# EAGLE design Risha Mega Shield (EAGLE 6.4)
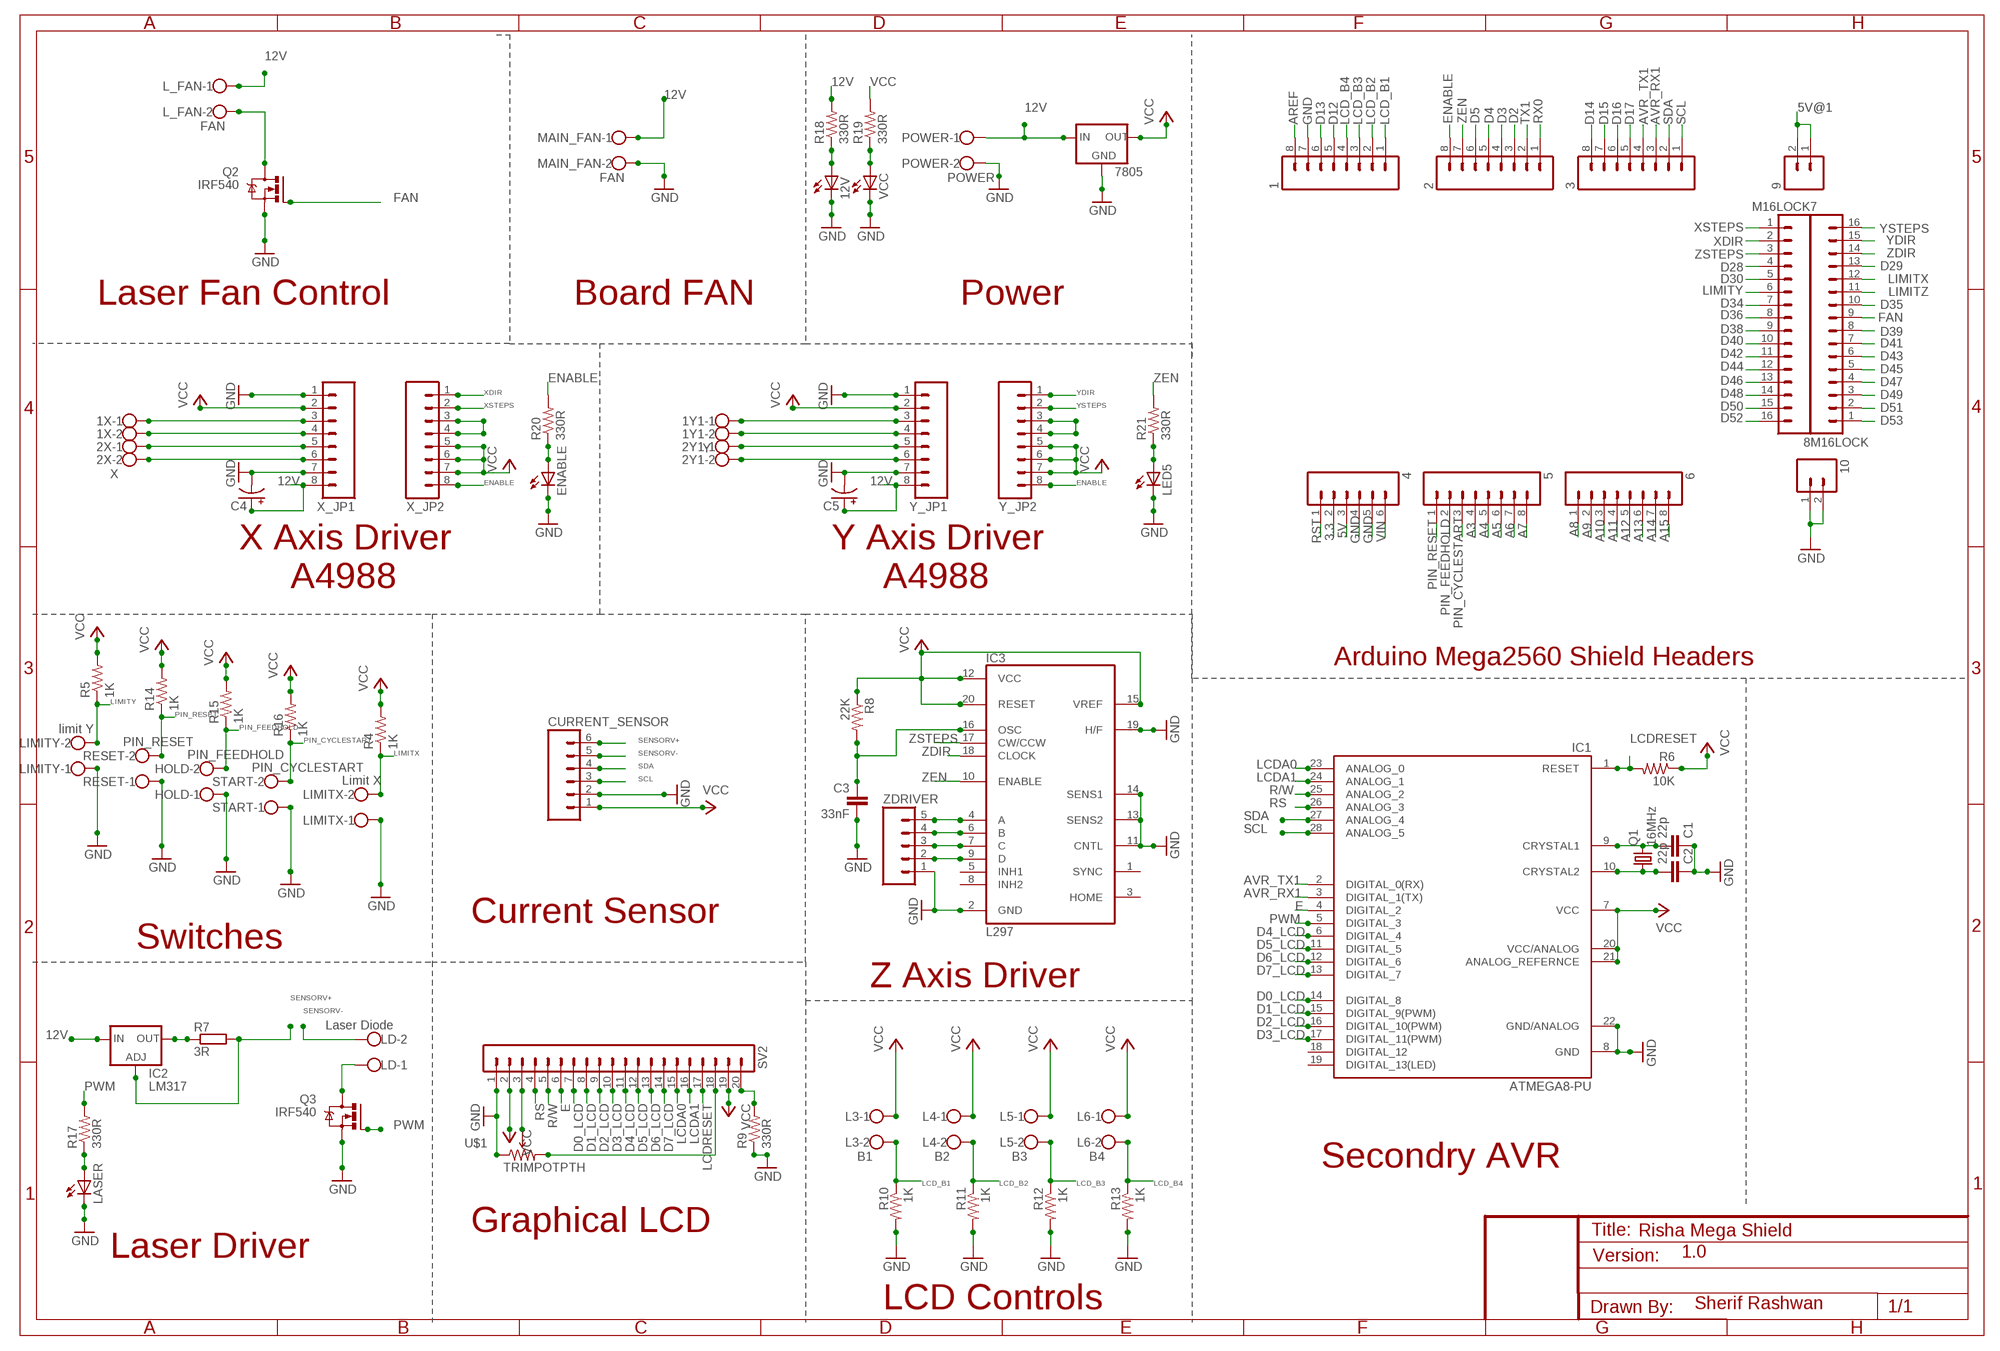
[diagram p0: schematic, sheet 1]

## Parts
1  M08LOCK  [1X08_LOCK]
1X  W237-102  [W237-102]
1Y1  Y  W237-102  [W237-102]
2  M08LOCK  [1X08_LOCK]
2X  X  W237-102  [W237-102]
2Y1  W237-102  [W237-102]
3  M08LOCK  [1X08_LOCK]
4  M06LOCK  [1X06_LOCK]
5  M08LOCK  [1X08_LOCK]
6  M08LOCK  [1X08_LOCK]
7  M16LOCK  [1X16_LOCK]
8  M16LOCK  [1X16_LOCK]
9  M02LOCK  [1X02_LOCK]
10  M02LOCK  [1X02_LOCK]
12V  LED3MM  [LED3MM]
7805  V_REG_78XXSINK  [TO220-IGO]
C1  22p  C2.5/2  [C2.5-2]
C2  22p  C2.5/2  [C2.5-2]
C3  33nF  C2.5/2  [C2.5-2]
C4  CAP_POLPTH2  [CPOL-RADIAL-10UF-25V]
C5  CAP_POLPTH2  [CPOL-RADIAL-10UF-25V]
CURRENT_SENSOR  M06LONGPADS  [1X06_LONGPADS]
ENABLE  LED3MM  [LED3MM]
HOLD  PIN_FEEDHOLD  W237-102  [W237-102]
IC1  ATMEGA8-PU  [DIL28-3]
IC2  LM317  LM317-TO3  [TO3-K02]
IC3  L297  [DIL20]
L3  B1  W237-102  [W237-102]
L4  B2  W237-102  [W237-102]
L5  B3  W237-102  [W237-102]
L6  B4  W237-102  [W237-102]
L_FAN  FAN  W237-102  [W237-102]
LASER  LED3MM  [LED3MM]
LD  Laser Diode  W237-102  [W237-102]
LED5  LED3MM  [LED3MM]
LIMITX  Limit X  W237-102  [W237-102]
LIMITY  limit Y  W237-102  [W237-102]
MAIN_FAN  FAN  W237-102  [W237-102]
POWER  POWER  W237-102  [W237-102]
Q1  16MHz  CRYSTALHC49US  [HC49US]
Q2  IRF540  [TO220BV]
Q3  IRF540  [TO220BV]
R4  1K  RESISTORPTH-1/6W  [1/6W-RES]
R5  1K  RESISTORPTH-1/6W  [1/6W-RES]
R6  10K  RESISTORPTH-1/6W  [1/6W-RES]
R7  3R  R-EU_0309/12  [0309/12]
R8  22K  RESISTORPTH-1/6W  [1/6W-RES]
R9  330R  RESISTORPTH-1/6W  [1/6W-RES]
R10  1K  RESISTORPTH-1/6W  [1/6W-RES]
R11  1K  RESISTORPTH-1/6W  [1/6W-RES]
R12  1K  RESISTORPTH-1/6W  [1/6W-RES]
R13  1K  RESISTORPTH-1/6W  [1/6W-RES]
R14  1K  RESISTORPTH-1/6W  [1/6W-RES]
R15  1K  RESISTORPTH-1/6W  [1/6W-RES]
R16  1K  RESISTORPTH-1/6W  [1/6W-RES]
R17  330R  RESISTORPTH-1/6W  [1/6W-RES]
R18  330R  RESISTORPTH-1/6W  [1/6W-RES]
R19  330R  RESISTORPTH-1/6W  [1/6W-RES]
R20  330R  RESISTORPTH-1/6W  [1/6W-RES]
R21  330R  RESISTORPTH-1/6W  [1/6W-RES]
RESET  PIN_RESET  W237-102  [W237-102]
START  PIN_CYCLESTART  W237-102  [W237-102]
SV2  MA20-1W  [MA20-1W]
U$1  TRIMPOTPTH  [TRIM_POT_PTH]
VCC  LED3MM  [LED3MM]
X_JP1  M08  [1X08]
X_JP2  M08  [1X08]
Y_JP1  M08  [1X08]
Y_JP2  M08  [1X08]
ZDRIVER  M05PTH_LONGPADS  [1X05_LONGPADS]

## Nets
3.3: 4.2
5V: 4.3
5V@1: 9.1 9.2
12V: 7805.IN C4.1(+) C5.1(+) IC2.1(IN) L_FAN.1 MAIN_FAN.1 POWER.1 R18.2 X_JP1.8 Y_JP1.8
A3: 5.4
A4: 5.5
A5: 5.6
A6: 5.7
A7: 5.8
A8: 6.1
A9: 6.2
A10: 6.3
A11: 6.4
A12: 6.5
A13: 6.6
A14: 6.7
A15: 6.8
AREF: 1.8
AVR_RX1: 3.3 IC1.3(DIGITAL_1(TX))
AVR_TX1: 3.4 IC1.2(DIGITAL_0(RX))
D0_LCD: IC1.14(DIGITAL_8) SV2.7
D1_LCD: IC1.15(DIGITAL_9(PWM)) SV2.8
D2: 2.3
D2_LCD: IC1.16(DIGITAL_10(PWM)) SV2.9
D3: 2.4
D3_LCD: IC1.17(DIGITAL_11(PWM)) SV2.10
D4: 2.5
D4_LCD: IC1.6(DIGITAL_4) SV2.11
D5: 2.6
D5_LCD: IC1.11(DIGITAL_5) SV2.12
D6_LCD: IC1.12(DIGITAL_6) SV2.13
D7_LCD: IC1.13(DIGITAL_7) SV2.14
D12: 1.5
D13: 1.6
D14: 3.8
D15: 3.7
D16: 3.6
D17: 3.5
D28: 8.4
D29: 7.13
D30: 8.5
D34: 8.7
D35: 7.10
D36: 8.8
D38: 8.9
D39: 7.8
D40: 8.10
D41: 7.7
D42: 8.11
D43: 7.6
D44: 8.12
D45: 7.5
D46: 8.13
D47: 7.4
D48: 8.14
D49: 7.3
D50: 8.15
D51: 7.2
D52: 8.16
D53: 7.1
E: IC1.4(DIGITAL_2) SV2.6
ENABLE: 2.8 R20.2 X_JP2.8 Y_JP2.8
FAN: 7.9 Q2.G
GND: 1.7 4.4 4.5 10.1 10.2 12V.K(C) 7805.GND C1.1 C2.1 C3.2 C4.2(-) C5.2(-) CURRENT_SENSOR.2 ENABLE.K(C) HOLD.1 IC1.8(GND) IC1.22(GND/ANALOG) IC3.2(GND) IC3.11(CNTL) IC3.13(SENS2) IC3.14(SENS1) IC3.19(H/F) LASER.K(C) LED5.K(C) LIMITX.1 LIMITY.1 MAIN_FAN.2 POWER.2 Q2.S Q3.S R9.1 R10.2 R11.2 R12.2 R13.2 RESET.1 START.1 SV2.1 U$1.1(CCW) VCC.K(C) X_JP1.1 X_JP1.7 Y_JP1.1 Y_JP1.7 ZDRIVER.1
LCD_B1: 1.1 L3.2 R10.1
LCD_B2: 1.2 L4.2 R11.1
LCD_B3: 1.3 L5.2 R12.1
LCD_B4: 1.4 L6.2 R13.1
LCDA0: IC1.23(ANALOG_0) SV2.15
LCDA1: IC1.24(ANALOG_1) SV2.16
LCDRESET: IC1.1(RESET) R6.2 SV2.17
LIMITX: 7.12 LIMITX.2 R4.1
LIMITY: 8.6 LIMITY.2 R5.1
LIMITZ: 7.11
N$1: L_FAN.2 Q2.D
N$2: 1Y1.1 Y_JP1.3
N$3: 1Y1.2 Y_JP1.4
N$4: 2Y1.1 Y_JP1.5
N$5: 2Y1.2 Y_JP1.6
N$6: Y_JP2.3 Y_JP2.4
N$7: C1.2 IC1.9(CRYSTAL1) Q1.2
N$8: C2.2 IC1.10(CRYSTAL2) Q1.1
N$9: LASER.A R17.1
N$10: IC2.3(OUT) R7.1
N$11: LD.1 Q3.D
N$12: IC3.4(A) ZDRIVER.5
N$13: C3.1 IC3.16(OSC) R8.2
N$14: IC3.6(B) ZDRIVER.4
N$15: IC3.7(C) ZDRIVER.3
N$16: IC3.9(D) ZDRIVER.2
N$17: SV2.3 U$1.2(WIPER)
N$18: 12V.A R18.1
N$19: SV2.18 U$1.3(CW)
N$20: R19.1 VCC.A
N$21: ENABLE.A R20.1
N$22: LED5.A R21.1
N$28: 1X.1 X_JP1.3
N$29: 1X.2 X_JP1.4
N$30: 2X.1 X_JP1.5
N$31: 2X.2 X_JP1.6
N$35: X_JP2.3 X_JP2.4
N$40: R9.2 SV2.20
PIN_CYCLESTART: 5.3 R16.1 START.2
PIN_FEEDHOLD: 5.2 HOLD.2 R15.1
PIN_RESET: 5.1 R14.1 RESET.2
PWM: IC1.5(DIGITAL_3) Q3.G R17.2
R/W: IC1.25(ANALOG_2) SV2.5
RS: IC1.26(ANALOG_3) SV2.4
RST: 4.1
RX0: 2.1
SCL: 3.1 CURRENT_SENSOR.3 IC1.28(ANALOG_5)
SDA: 3.2 CURRENT_SENSOR.4 IC1.27(ANALOG_4)
SENSORV+: CURRENT_SENSOR.6 IC2.2(ADJ) R7.2
SENSORV-: CURRENT_SENSOR.5 LD.2
TX1: 2.2
VCC: 7805.OUT CURRENT_SENSOR.1 IC1.7(VCC) IC1.20(VCC/ANALOG) IC1.21(ANALOG_REFERNCE) IC3.12(VCC) IC3.15(VREF) IC3.20(RESET) L3.1 L4.1 L5.1 L6.1 R4.2 R5.2 R6.1 R8.1 R14.2 R15.2 R16.2 R19.2 SV2.2 SV2.19 X_JP1.2 X_JP2.5 X_JP2.6 X_JP2.7 Y_JP1.2 Y_JP2.5 Y_JP2.6 Y_JP2.7
VIN: 4.6
XDIR: 8.2 X_JP2.1
XSTEPS: 8.1 X_JP2.2
YDIR: 7.15 Y_JP2.1
YSTEPS: 7.16 Y_JP2.2
ZDIR: 7.14 IC3.18(CLOCK)
ZEN: 2.7 IC3.10(ENABLE) R21.2
ZSTEPS: 8.3 IC3.17(CW/CCW)
Unconnected: IC1.18(DIGITAL_12) IC1.19(DIGITAL_13(LED)) IC3.1(SYNC) IC3.3(HOME) IC3.5(INH1) IC3.8(INH2)

## Notes on the sheet
- Laser Fan Control | Board FAN | Power
- X Axis Driver | Y Axis Driver
- A4988 | A4988
- Arduino Mega2560 Shield Headers
- Current Sensor
- Switches
- Z Axis Driver
- Secondry AVR
- Graphical LCD
- Laser Driver | 1.0
- LCD Controls | Sherif Rashwan

## Library data of the parts
1-3 5 6 = SparkFun:M08: Header 8 Standard 8-pin 0.1" header. Use with straight break away headers (SKU : PRT-00116), right angle break away headers (PRT-00553), swiss pins (PRT-00743), machine pins (PRT-00117), and female headers (PRT-00115).
1X 1Y1 2X 2Y1 HOLD L3-L6 L_FAN LD LIMITX LIMITY MAIN_FAN POWER RESET START = con-wago-500:W237-102: WAGO SCREW CLAMP; MPN: 237-102; OC_FARNELL: unknown; OC_NEWARK: 70K9898
4 = SparkFun:M06: Header 6 Standard 6-pin 0.1" header. Use with straight break away headers (SKU : PRT-00116), right angle break away headers (PRT-00553), swiss pins (PRT-00743), machine pins (PRT-00117), and female headers (PRT-00115). Molex polarized connector foot print use with SKU : PRT-08094 with associated crimp pins and housings. NOTES ON THE VARIANTS LOCK and LOCK_LONGPADS... This footprint was designed to help hold the alignment of a through-hole component (i.e. 6-pin header) while soldering it into place. You may notice that each hole has been shifted either up or down by 0.005 of an inch from it's more standard position (which is a perfectly straight line). This slight alteration caused the pins (the squares in the middle) to touch the edges of the holes. Because they are alternating, it causes a "brace" to hold the component in place. 0.005 has proven to be the perfect amount of "off-center" position when using our standard breakaway headers. Although looks a little odd when you look at the bare footprint, once you have a header in there, the alteration is very hard to notice. Also, if you push a header all the way into place, it is covered up entirely on the bottom side. This idea of altering the position of holes to aid alignment will be further integrated into the Sparkfun Library for other footprints. It can help hold any component with 3 or more connection pins.
7 8 = SparkFun:M16
9 10 = SparkFun:M02: Header 2 Standard 2-pin 0.1" header. Use with straight break away headers (SKU : PRT-00116), right angle break away headers (PRT-00553), swiss pins (PRT-00743), machine pins (PRT-00117), and female headers (PRT-00115). Molex polarized connector foot print use with SKU : PRT-08233 with associated crimp pins and housings.
12V ENABLE LASER LED5 VCC = 01_SparkFun:LED: LEDs Standard schematic elements and footprints for 5mm, 3mm, 1206, and 0603 sized LEDs. 5mm - Spark Fun Electronics SKU : COM-00529 (and others)
7805 = 01_SparkFun:V_REG_78XX: Voltage Regulator Standard 7805 5V regulator. IGO (Input Ground Output). Spark Fun Electronics SKU : COM-00107
C1-C3 = capacitor-wima:C: CAPACITOR naming: grid - package width
C4 C5 = 01_SparkFun:CAP_POL: Capacitor Polarized These are standard SMD and PTH capacitors. Normally 10uF, 47uF, and 100uF in electrolytic and tantalum varieties. Always verify the external diameter of the through hole cap, it varies with capacity, voltage, and manufacturer. The EIA devices should be standard.
CURRENT_SENSOR = 01_SparkFun:M06: Header 6 Standard 6-pin 0.1" header. Use with straight break away headers (SKU : PRT-00116), right angle break away headers (PRT-00553), swiss pins (PRT-00743), machine pins (PRT-00117), and female headers (PRT-00115). Molex polarized connector foot print use with SKU : PRT-08094 with associated crimp pins and housings. NOTES ON THE VARIANTS LOCK and LOCK_LONGPADS... This footprint was designed to help hold the alignment of a through-hole component (i.e. 6-pin header) while soldering it into place. You may notice that each hole has been shifted either up or down by 0.005 of an inch from it's more standard position (which is a perfectly straight line). This slight alteration caused the pins (the squares in the middle) to touch the edges of the holes. Because they are alternating, it causes a "brace" to hold the component in place. 0.005 has proven to be the perfect amount of "off-center" position when using our standard breakaway headers. Although looks a little odd when you look at the bare footprint, once you have a header in there, the alteration is very hard to notice. Also, if you push a header all the way into place, it is covered up entirely on the bottom side. This idea of altering the position of holes to aid alignment will be further integrated into the Sparkfun Library for other footprints. It can help hold any component with 3 or more connection pins.
IC1 = 01_Arduino-AVR:ATMEGA8-PU
IC2 = v-reg:LM317-TO3: VOLTAGE REGULATOR
IC3 = st-microelectronics:L297: STEPPER MOTOR CONTROLLER; MPN: L297/1; OC_FARNELL: 1094209; OC_NEWARK: 56P8258
Q1 = 01_SparkFun:CRYSTAL: Crystals Various standard crystals. Proven footprints. Spark Fun Electronics SKU : COM-00534
Q2 Q3 = transistor-power:IRF540: HEXFET Power MOSFET
R4-R6 R8-R21 = 01_SparkFun:RESISTOR: Resistor Basic schematic elements and footprints for 0603, 1206, and PTH 1/10th watt (small) resistors.
R7 = rcl:R-EU_: RESISTOR, European symbol
SV2 = con-lstb:MA20-1W: PIN HEADER; OC_FARNELL: unknown; OC_NEWARK: unknown
U$1 = 01_SparkFun:TRIMPOT
X_JP1 X_JP2 Y_JP1 Y_JP2 = 01_SparkFun:M08: Header 8 Standard 8-pin 0.1" header. Use with straight break away headers (SKU : PRT-00116), right angle break away headers (PRT-00553), swiss pins (PRT-00743), machine pins (PRT-00117), and female headers (PRT-00115).
ZDRIVER = 01_SparkFun:M05: Header 5 Standard 5-pin 0.1" header. Use with straight break away headers (SKU : PRT-00116), right angle break away headers (PRT-00553), swiss pins (PRT-00743), machine pins (PRT-00117), and female headers (PRT-00115). Molex polarized connector foot print use with SKU : PRT-08230 with associated crimp pins and housings.

## Board
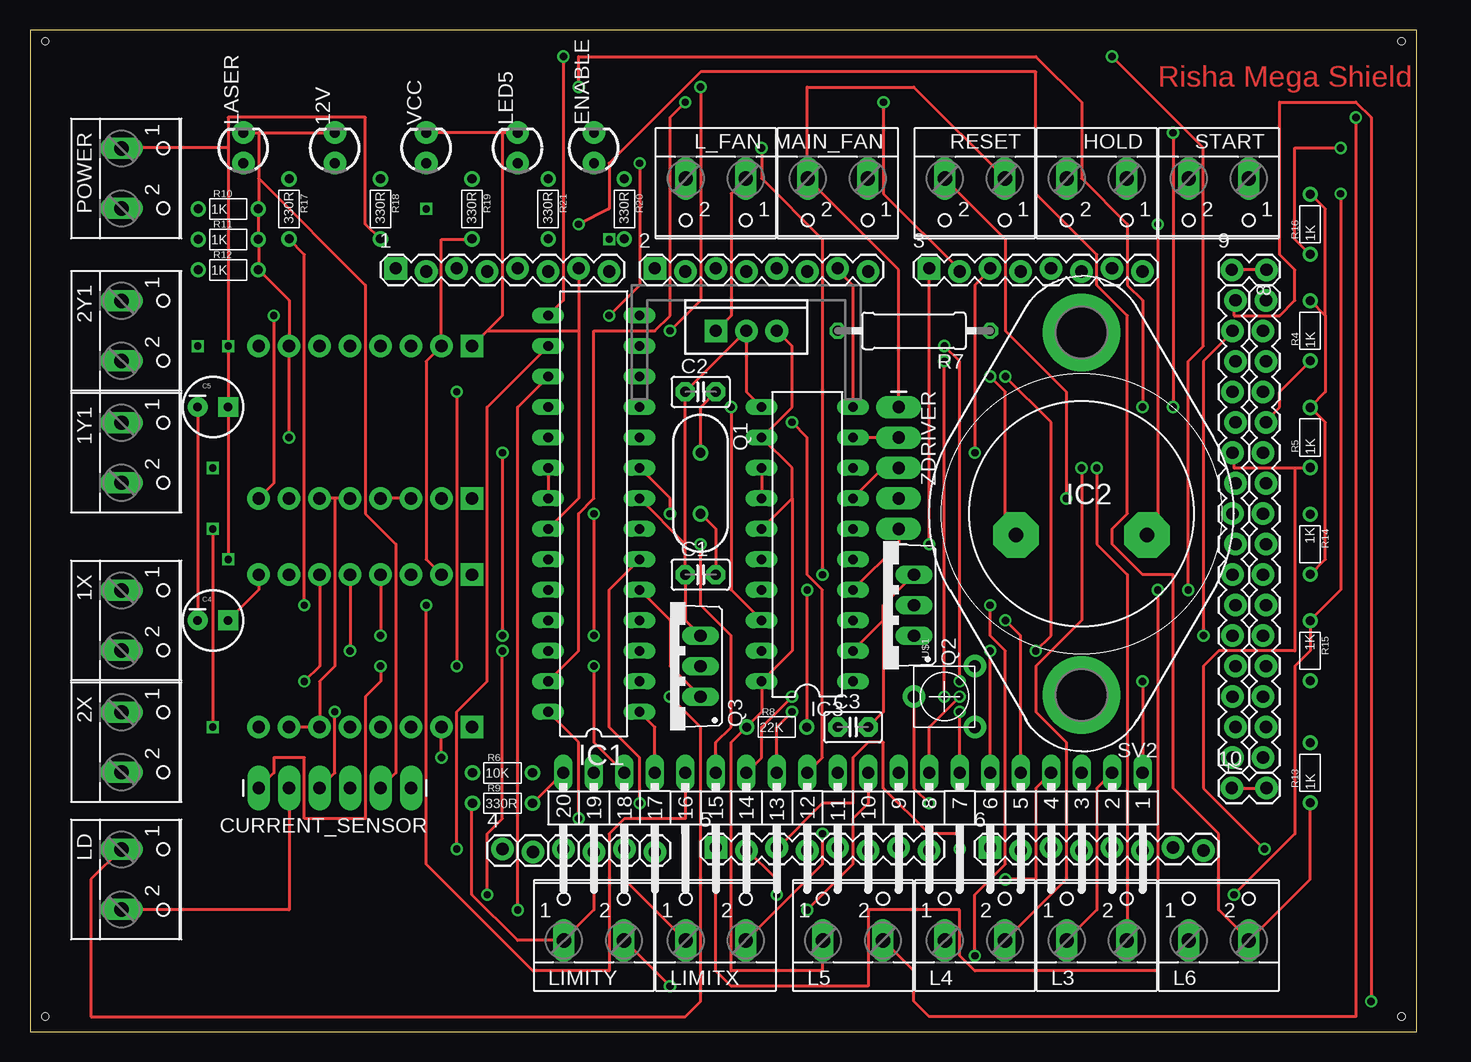
[diagram p1: board, top side]
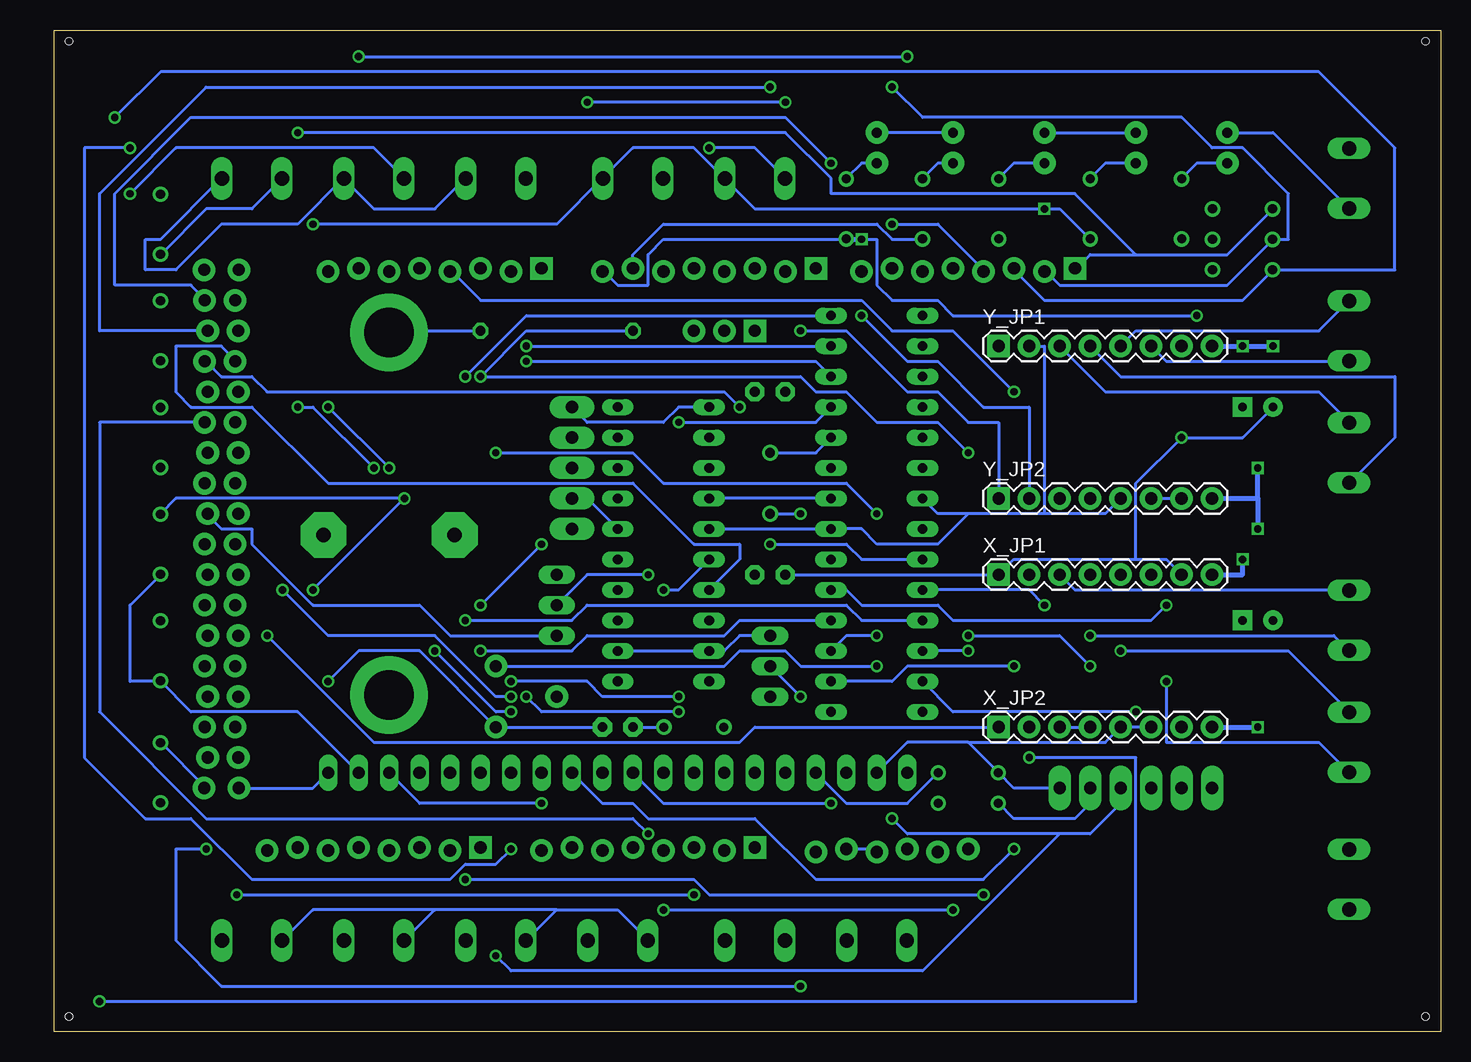
[diagram p2: board, bottom side, seen from below]

Size 115.55 x 83.49 mm. Coordinates in mm from the lower left corner, seen from the top.
Outline: 0,0 115.55,0 115.55,83.49 0,83.49 0,0
Copper layers (1*16): Top 0.035mm / dielectric 1.5mm / Bottom 0.035mm
Design rules "default": minimum track width 10mil, minimum drill 24mil, track to track 8mil, track to pad 8mil, pad to pad 8mil, via to via 8mil, smd to smd 8mil, copper to edge 40mil, drill to drill 8mil, minimum pad ring 10mil, minimum via ring 8mil, stop-mask expansion 4mil, vias tented up to drill 0mil, thermal gap 10mil
Holes 0.6 mm at 1.27,82.55 1.27,1.27 114.3,82.55 114.3,1.27

### Footprints (pad centres in the part's own frame; a part is rotated, then mirrored left to right if it is on the bottom)
1X08_LOCK = drill 1.016 pad 1.88 square: 1 0,0.127 | drill 1.016 pad 1.88: 2 2.54,-0.127; 3 5.08,0.127; 4 7.62,-0.127; 5 10.16,0.127; 6 12.7,-0.127; 7 15.24,0.127; 8 17.78,-0.127
W237-102 = drill 1.194 long: 1 -2.5,-1.27; 2 2.5,-1.27
1X06_LOCK = drill 1.016 pad 1.88: 1 0,0; 2 2.54,-0.254; 3 5.08,0; 4 7.62,-0.254; 5 10.16,0; 6 12.7,-0.254
1X16_LOCK = drill 1.016 pad 1.88: 1 0,0.127; 2 2.54,-0.127; 3 5.08,0.127; 4 7.62,-0.127; 5 10.16,0.127; 6 12.7,-0.127; 7 15.24,0.127; 8 17.78,-0.127; 9 20.32,0.127; 10 22.86,-0.127; 11 25.4,0.127; 12 27.94,-0.127; 13 30.48,0.127; 14 33.02,-0.127; 15 35.56,0.127; 16 38.1,-0.127
1X02_LOCK = drill 1.016 pad 1.88: 1 -0.178,0; 2 2.718,0
LED3MM = drill 0.813 pad 1.88: A -1.27,0; K 1.27,0
TO220-IGO = drill 1 pad 1.88: GND 0,0; OUT 2.54,0 | drill 1 pad 1.88 square: IN -2.54,0
C2.5-2 = drill 0.813 pad 1.6 octagon: 1 -1.27,0; 2 1.27,0
CPOL-RADIAL-10UF-25V = drill 0.7 pad 1.651 square: 1 1.27,0 | drill 0.7 pad 1.651: 2 -1.27,0
1X06_LONGPADS = drill 1.016 pad 1.88 long: 1 0,0; 2 2.54,0; 3 5.08,0; 4 7.62,0; 5 10.16,0; 6 12.7,0
DIL28-3 = drill 0.813 long: 1 -16.51,-3.81; 2 -13.97,-3.81; 3 -11.43,-3.81; 4 -8.89,-3.81; 5 -6.35,-3.81; 6 -3.81,-3.81; 7 -1.27,-3.81; 8 1.27,-3.81; 9 3.81,-3.81; 10 6.35,-3.81; 11 8.89,-3.81; 12 11.43,-3.81; 13 13.97,-3.81; 14 16.51,-3.81; 15 16.51,3.81; 16 13.97,3.81; 17 11.43,3.81; 18 8.89,3.81; 19 6.35,3.81; 20 3.81,3.81; 21 1.27,3.81; 22 -1.27,3.81; 23 -3.81,3.81; 24 -6.35,3.81; 25 -8.89,3.81; 26 -11.43,3.81; 27 -13.97,3.81; 28 -16.51,3.81
TO3-K02 = drill 1.194 pad 3.81 octagon: 1 -1.778,-5.461; 2 -1.778,5.461 | drill 4.115 pad 6.477: 3 15.113,0; 3@ -15.113,0
DIL20 = drill 0.813 long: 1 -11.43,-3.81; 2 -8.89,-3.81; 3 -6.35,-3.81; 4 -3.81,-3.81; 5 -1.27,-3.81; 6 1.27,-3.81; 7 3.81,-3.81; 8 6.35,-3.81; 9 8.89,-3.81; 10 11.43,-3.81; 11 11.43,3.81; 12 8.89,3.81; 13 6.35,3.81; 14 3.81,3.81; 15 1.27,3.81; 16 -1.27,3.81; 17 -3.81,3.81; 18 -6.35,3.81; 19 -8.89,3.81; 20 -11.43,3.81
HC49US = drill 0.813: 1 -2.54,0; 2 2.54,0
TO220BV = drill 1.016 long: D 0,-2.54; G -2.54,-2.54; S 2.54,-2.54
1/6W-RES = drill 0.762: 1 -2.5,0; 2 2.5,0
0309/12 = drill 0.813 octagon: 1 -6.35,0; 2 6.35,0
MA20-1W = drill 1.016 long: 1 -24.13,0; 2 -21.59,0; 3 -19.05,0; 4 -16.51,0; 5 -13.97,0; 6 -11.43,0; 7 -8.89,0; 8 -6.35,0; 9 -3.81,0; 10 -1.27,0; 11 1.27,0; 12 3.81,0; 13 6.35,0; 14 8.89,0; 15 11.43,0; 16 13.97,0; 17 16.51,0; 18 19.05,0; 19 21.59,0; 20 24.13,0
TRIM_POT_PTH = drill 1 pad 1.88: 1 -2.54,-2.54; 2 0,2.54; 3 2.54,-2.54
1X08 = drill 1.016 pad 1.88 square: 1 0,0 | drill 1.016 pad 1.88: 2 2.54,0; 3 5.08,0; 4 7.62,0; 5 10.16,0; 6 12.7,0; 7 15.24,0; 8 17.78,0
1X05_LONGPADS = drill 1.016 pad 1.88 long: 1 0,0; 2 2.54,0; 3 5.08,0; 4 7.62,0; 5 10.16,0

### Placement (x,y rotation side)
1  30.48,63.5 0 top
1X  8.89,34.29 270 top
1Y1  8.89,48.26 270 top
2  52.07,63.5 0 top
2X  8.89,24.13 270 top
2Y1  8.89,58.42 270 top
3  74.93,63.5 0 top
4  39.37,15.24 0 top
5  57.15,15.24 0 top
6  80.01,15.24 0 top
7  102.87,22.86 90 top
8  100.33,60.96 270 top
9  100.33,63.5 0 top
10  100.33,20.32 0 top
12V  25.4,73.66 90 top
7805  59.69,58.42 0 top
C1  55.88,38.1 0 top
C2  55.88,53.34 0 top
C3  68.58,25.4 0 top
C4  15.24,34.29 0 top
C5  15.24,52.07 0 top
CURRENT_SENSOR  31.75,20.32 180 top
ENABLE  46.99,73.66 90 top
HOLD  88.9,69.85 180 top
IC1  46.99,43.18 90 top
IC2  87.63,43.18 90 top
IC3  64.77,40.64 90 top
L3  88.9,8.89 0 top
L4  78.74,8.89 0 top
L5  68.58,8.89 0 top
L6  99.06,8.89 0 top
L_FAN  57.15,69.85 180 top
LASER  17.78,73.66 90 top
LD  8.89,12.7 270 top
LED5  40.64,73.66 90 top
LIMITX  57.15,8.89 0 top
LIMITY  46.99,8.89 0 top
MAIN_FAN  67.31,69.85 180 top
POWER  8.89,71.12 270 top
Q1  55.88,45.72 270 top
Q2  71.12,35.56 90 top
Q3  53.34,30.48 90 top
R4  106.68,58.42 90 top
R5  106.68,49.53 90 top
R6  39.37,21.59 0 top
R7  73.66,58.42 180 top
R8  62.23,25.4 0 top
R9  39.37,19.05 0 top
R10  16.51,68.58 0 top
R11  16.51,66.04 0 top
R12  16.51,63.5 0 top
R13  106.68,21.59 90 top
R14  106.68,40.64 270 top
R15  106.68,31.75 270 top
R16  106.68,67.31 90 top
R17  21.59,68.58 270 top
R18  29.21,68.58 270 top
R19  36.83,68.58 270 top
R20  49.53,68.58 270 top
R21  43.18,68.58 270 top
RESET  78.74,69.85 180 top
START  99.06,69.85 180 top
SV2  68.58,21.59 180 top
U$1  76.2,27.94 90 top
VCC  33.02,73.66 90 top
X_JP1  36.83,38.1 0 bottom
X_JP2  36.83,25.4 0 bottom
Y_JP1  36.83,57.15 0 bottom
Y_JP2  36.83,44.45 0 bottom
ZDRIVER  72.39,52.07 270 top

### Tracks (layer width: path | path; a pad name or v marks a point on that pad's centre or on a via)
5V@1
  Top 0.254: 9.2 9.1
12V  (via drill 0.6, 0.61)
  Top 0.254: 16.51,73.66 7.62,73.66 POWER.1 | 16.51,73.66 16.51,76.2 27.94,76.2 27.94,67.31 29.21,66.04 R18.2 | 7805.IN 58.42,59.69 58.42,69.85 59.69,71.12 L_FAN.1 | v93.98,67.31 93.98,41.91 IC2.1 | C4.1 19.05,36.83 X_JP1.8 | v16.51,39.37 C5.1 v16.51,57.15 16.51,73.66
  Bottom 0.254: 59.69,71.12 57.15,68.58 v33.02,68.58 31.75,68.58 29.21,66.04 R18.2 | 69.85,71.12 67.31,73.66 62.23,73.66 59.69,71.12 | 59.69,71.12 L_FAN.1 | v93.98,67.31 73.66,67.31 69.85,71.12 | 69.85,71.12 MAIN_FAN.1
  Bottom 0.406: X_JP1.8 16.51,38.1 v16.51,39.37 | Y_JP1.8 v16.51,57.15 13.97,57.15
AVR_RX1  (via drill 0.61)
  Top 0.254: v46.99,43.18 v46.99,33.02 | v78.74,48.26 78.74,62.23 80.01,63.5 3.3
  Bottom 0.254: IC1.3 49.53,33.02 v46.99,33.02 | v46.99,43.18 49.53,45.72 64.77,45.72 67.31,48.26 v78.74,48.26
AVR_TX1  (via drill 0.61)
  Top 0.254: v35.56,53.34 v35.56,30.48
  Bottom 0.254: IC1.2 45.72,29.21 44.45,30.48 v35.56,30.48 | v35.56,53.34 40.64,58.42 45.72,58.42 48.26,60.96 80.01,60.96 82.55,63.5 3.4
D0_LCD  (via drill 0.61)
  Top 0.254: v81.28,54.61 85.09,50.8 85.09,33.02 v83.82,31.75 | SV2.7 v77.47,26.67
  Bottom 0.254: IC1.14 76.2,59.69 v81.28,54.61 | v83.82,31.75 78.74,26.67 v77.47,26.67
D1_LCD  (via drill 0.61)
  Top 0.254: IC1.15 44.45,60.96 v44.45,81.28 | v90.17,81.28 97.79,73.66 97.79,57.15 96.52,55.88 v96.52,36.83 | v77.47,27.94 74.93,25.4 SV2.8
  Bottom 0.254: v90.17,81.28 v44.45,81.28 | v96.52,36.83 92.71,33.02 83.82,33.02 78.74,27.94 v77.47,27.94
D2_LCD  (via drill 0.61)
  Top 0.254: IC1.16 38.1,52.07 38.1,29.21 35.56,26.67 v35.56,15.24
  Bottom 0.254: v35.56,15.24 38.1,12.7 52.07,12.7 57.15,17.78 66.04,17.78 67.31,19.05 69.85,19.05 SV2.9
D3_LCD  (via drill 0.61)
  Top 0.254: IC1.17 40.64,52.07 v40.64,10.16 | v64.77,10.16 68.58,13.97 68.58,17.78 69.85,19.05 SV2.10
  Bottom 0.254: v64.77,10.16 v40.64,10.16
D4_LCD  (via drill 0.61)
  Top 0.254: IC1.6 48.26,36.83 48.26,25.4 50.8,22.86 v50.8,19.05
  Bottom 0.254: v50.8,19.05 64.77,19.05 SV2.11
D5_LCD  (via drill 0.61)
  Top 0.254: v63.5,50.8 64.77,49.53 64.77,38.1 66.04,36.83 66.04,22.86 SV2.12
  Bottom 0.254: IC1.11 52.07,50.8 v63.5,50.8
D6_LCD  (via drill 0.61)
  Top 0.254: v76.2,27.94 v76.2,55.88 | v63.5,26.67 62.23,25.4 SV2.13
  Bottom 0.254: IC1.12 52.07,55.88 v76.2,55.88 | v76.2,27.94 74.93,26.67 v63.5,26.67
D7_LCD  (via drill 0.61)
  Top 0.254: v76.2,57.15 77.47,55.88 v77.47,29.21 | v63.5,27.94 60.96,25.4 60.96,22.86 SV2.14
  Bottom 0.254: v76.2,57.15 IC1.13 | v77.47,29.21 71.12,29.21 69.85,27.94 v63.5,27.94
E  (via drill 0.61)
  Top 0.254: SV2.6 v80.01,31.75
  Bottom 0.254: IC1.4 58.42,34.29 59.69,33.02 71.12,33.02 72.39,31.75 v80.01,31.75
ENABLE  (via drill 0.6, 0.61)
  Top 0.254: v15.24,41.91 v15.24,25.4 | Y_JP2.8 20.32,45.72 v20.32,59.69
  Bottom 0.254: R20.2 49.53,66.04 64.77,66.04 66.04,64.77 66.04,62.23 68.58,62.23 69.85,63.5 2.8 | v20.32,59.69 40.64,59.69 41.91,60.96 45.72,60.96 46.99,62.23 46.99,66.04 v48.26,66.04
  Bottom 0.406: Y_JP2.8 15.24,44.45 | X_JP2.8 v15.24,25.4 | 15.24,44.45 v15.24,41.91 | 15.24,44.45 v15.24,46.99 | 49.53,66.04 v48.26,66.04
FAN
  Bottom 0.254: Q2.G 82.55,33.02 85.09,35.56 93.98,35.56 99.06,40.64 99.06,41.91 101.6,41.91 102.87,43.18 7.9
GND  (via drill 0.61)
  Top 0.254: 4.5 49.53,12.7 54.61,7.62 LIMITX.1 | 44.45,7.62 46.99,10.16 4.4 46.99,15.24 | 44.45,7.62 40.64,7.62 36.83,11.43 36.83,19.05 R9.1 | 44.45,7.62 LIMITY.1 | 19.05,66.04 19.05,63.5 | 19.05,66.04 19.05,68.58 | 19.05,66.04 R11.2 | 19.05,63.5 21.59,60.96 Y_JP1.7 v21.59,49.53 | 19.05,63.5 R12.2 | LASER.K 19.05,74.93 | 19.05,74.93 12V.K | 19.05,74.93 19.05,71.12 | 19.05,71.12 19.05,68.58 | 19.05,68.58 R10.2 | IC1.22 45.72,44.45 45.72,58.42 | 1.7 45.72,58.42 | LED5.K 39.37,74.93 | 39.37,74.93 VCC.K | 38.1,58.42 39.37,59.69 39.37,74.93 | 38.1,58.42 Y_JP1.1 | 38.1,58.42 45.72,58.42 | CURRENT_SENSOR.2 30.48,21.59 30.48,40.64 27.94,43.18 27.94,62.23 19.05,71.12 | 10.1 10.2 | Q2.S 71.12,35.56 71.12,34.29 | IC3.2 71.12,34.29 | C3.2 71.12,26.67 71.12,34.29 | v92.71,29.21 SV2.1 | 64.77,71.12 72.39,63.5 ZDRIVER.1 | IC3.11 59.69,53.34 7805.GND C2.1 54.61,40.64 | IC3.13 IC3.14 | 54.61,40.64 IC1.8 | 54.61,40.64 C1.1 54.61,34.29 Q3.S | 64.77,71.12 64.77,78.74 73.66,78.74 81.28,71.12 RESET.1 | 64.77,71.12 MAIN_FAN.2 | C5.2 C4.2
  Bottom 0.254: CURRENT_SENSOR.2 29.21,19.05 30.48,17.78 35.56,17.78 36.83,19.05 R9.1 | 4.5 46.99,15.24 4.4 | LASER.K 13.97,74.93 7.62,68.58 POWER.2 | LED5.K ENABLE.K | VCC.K 12V.K | R13.2 106.68,24.13 102.87,20.32 10.2 | SV2.1 93.98,20.32 10.1 100.33,20.32 | C3.2 U$1.1 85.09,31.75 90.17,31.75 v92.71,29.21 | IC3.2 IC3.19 59.69,31.75 58.42,33.02 Q3.S | 91.44,71.12 88.9,68.58 83.82,68.58 81.28,71.12 RESET.1 | 91.44,71.12 95.25,67.31 101.6,67.31 105.41,63.5 107.95,63.5 107.95,66.04 106.68,66.04 101.6,71.12 START.1 | 91.44,71.12 HOLD.1 | X_JP1.7 22.86,39.37 25.4,39.37 | 25.4,39.37 35.56,39.37 X_JP1.1 C1.1 | IC1.8 IC3.14 | ZDRIVER.1 71.12,50.8 64.77,50.8 63.5,52.07 IC3.11 | 25.4,39.37 25.4,45.72 v21.59,49.53 16.51,49.53 C5.2
LCD_B1  (via drill 0.61)
  Top 0.254: v88.9,46.99 88.9,40.64 91.44,38.1 91.44,7.62 L3.2 | v95.25,74.93 v95.25,52.07
  Bottom 0.254: 25.4,64.77 29.21,64.77 30.48,63.5 1.1 | 25.4,64.77 17.78,64.77 13.97,68.58 R10.1 | v88.9,46.99 93.98,52.07 v95.25,52.07 | v95.25,74.93 54.61,74.93 50.8,71.12 50.8,69.85 30.48,69.85 25.4,64.77
LCD_B2  (via drill 0.61)
  Top 0.254: v87.63,46.99 87.63,34.29 83.82,30.48 83.82,26.67 86.36,24.13 86.36,12.7 81.28,7.62 L4.2 | v92.71,52.07 92.71,60.96 91.44,62.23 91.44,67.31 87.63,71.12 87.63,77.47 83.82,81.28 45.72,81.28 v45.72,78.74
  Bottom 0.254: 13.97,66.04 17.78,62.23 31.75,62.23 33.02,63.5 1.2 | v92.71,52.07 v87.63,46.99 | v45.72,78.74 43.18,76.2 21.59,76.2 19.05,73.66 16.51,73.66 12.7,69.85 12.7,66.04 13.97,66.04 | 13.97,66.04 R11.1
LCD_B3  (via drill 0.61)
  Top 0.254: v110.49,76.2 110.49,1.27 74.93,1.27 73.66,2.54 73.66,5.08 71.12,7.62 L5.2
  Bottom 0.254: 13.97,63.5 16.51,60.96 33.02,60.96 35.56,63.5 1.3 | v110.49,76.2 106.68,80.01 10.16,80.01 3.81,73.66 3.81,63.5 13.97,63.5 | 13.97,63.5 R12.1
LCD_B4  (via drill 0.61)
  Top 0.254: R13.1 106.68,12.7 101.6,7.62 | v45.72,67.31 48.26,68.58 48.26,72.39 55.88,80.01 83.82,80.01 83.82,69.85 88.9,64.77 88.9,62.23 91.44,59.69 91.44,43.18 90.17,41.91 90.17,40.64 92.71,38.1 95.25,38.1 95.25,20.32 99.06,16.51 99.06,10.16 101.6,7.62 | 101.6,7.62 L6.2
  Bottom 0.254: v45.72,67.31 41.91,67.31 38.1,63.5 1.4
LCDA0  (via drill 0.61)
  Top 0.254: v55.88,40.64 55.88,35.56 58.42,33.02 58.42,25.4 57.15,24.13 SV2.15
  Bottom 0.254: IC1.23 48.26,39.37 49.53,40.64 v55.88,40.64
LCDA1  (via drill 0.61)
  Top 0.254: v33.02,35.56 33.02,13.97 41.91,5.08 48.26,5.08 48.26,16.51 49.53,17.78 54.61,17.78 SV2.16
  Bottom 0.254: IC1.24 34.29,36.83 v33.02,35.56
LCDRESET
  Top 0.254: IC1.1 52.07,25.4 SV2.17
  Bottom 0.254: SV2.17 49.53,19.05 44.45,19.05 41.91,21.59 R6.2
LIMITX  (via drill 0.61)
  Top 0.254: R4.1 106.68,55.88 104.14,53.34 104.14,52.07 102.87,50.8 7.12 | v66.04,16.51 66.04,13.97 59.69,7.62 LIMITX.2
  Bottom 0.254: v66.04,16.51 67.31,17.78 102.87,17.78 111.76,26.67 111.76,50.8 7.12 102.87,50.8
LIMITY  (via drill 0.61)
  Top 0.254: 105.41,46.99 100.33,46.99 100.33,48.26 8.6 | 105.41,46.99 106.68,46.99 R5.1 | v53.34,3.81 49.53,7.62 LIMITY.2 | v102.87,15.24 97.79,20.32 97.79,30.48 99.06,31.75 105.41,31.75 105.41,46.99
  Bottom 0.254: v53.34,3.81 101.6,3.81 105.41,7.62 105.41,15.24 v102.87,15.24
N$1  (via drill 0.61)
  Top 0.254: v66.04,38.1 66.04,66.04 60.96,71.12 v60.96,73.66
  Bottom 0.254: Q2.D 71.12,38.1 v66.04,38.1 | v60.96,73.66 57.15,73.66 54.61,71.12 L_FAN.2
N$2
  Bottom 0.254: Y_JP1.3 27.94,53.34 10.16,53.34 7.62,50.8 1Y1.1
N$3
  Bottom 0.254: Y_JP1.4 26.67,54.61 3.81,54.61 3.81,49.53 7.62,45.72 1Y1.2
N$4
  Bottom 0.254: Y_JP1.5 25.4,58.42 10.16,58.42 7.62,60.96 2Y1.1
N$5
  Bottom 0.254: Y_JP1.6 22.86,55.88 7.62,55.88 2Y1.2
N$6
  Top 0.254: Y_JP2.3 Y_JP2.4
N$7  (via drill 0.61)
  Top 0.254: IC1.9 53.34,44.45 v53.34,43.18 | C1.2 57.15,41.91 Q1.2
  Bottom 0.254: Q1.2 v53.34,43.18
N$8
  Top 0.254: C2.2 55.88,52.07 Q1.1
  Bottom 0.254: IC1.10 52.07,48.26 Q1.1
N$9
  Bottom 0.254: LASER.A 20.32,72.39 21.59,71.12 R17.1
N$10
  Bottom 0.254: R7.1 87.63,58.42 IC2.3
N$11  (via drill 0.61)
  Top 0.254: v53.34,27.94 55.88,25.4 55.88,2.54 54.61,1.27 5.08,1.27 5.08,12.7 7.62,15.24 LD.1
  Bottom 0.254: v53.34,27.94 Q3.D
N$12
  Top 0.254: IC3.4 72.39,40.64 ZDRIVER.5
N$13  (via drill 0.61)
  Top 0.254: v64.77,36.83 64.77,25.4 R8.2
  Bottom 0.254: C3.1 R8.2 | IC3.16 63.5,36.83 v64.77,36.83
N$14
  Bottom 0.254: IC3.6 71.12,44.45 ZDRIVER.4
N$15
  Top 0.254: IC3.7 71.12,46.99 ZDRIVER.3
N$16
  Top 0.254: ZDRIVER.2 IC3.9
N$17  (via drill 0.61)
  Top 0.254: v74.93,19.05 73.66,20.32 U$1.2
  Bottom 0.254: SV2.3 85.09,19.05 v74.93,19.05
N$18
  Bottom 0.254: 12V.A 27.94,72.39 29.21,71.12 R18.1
N$19  (via drill 0.61)
  Top 0.254: SV2.18 46.99,24.13 v46.99,30.48
  Bottom 0.254: v46.99,30.48 53.34,30.48 54.61,31.75 58.42,31.75 59.69,30.48 U$1.3
N$20
  Bottom 0.254: VCC.A 35.56,72.39 36.83,71.12 R19.1
N$21
  Bottom 0.254: ENABLE.A 48.26,72.39 49.53,71.12 R20.1
N$22
  Bottom 0.254: LED5.A 41.91,72.39 43.18,71.12 R21.1
N$23  (via drill 0.6)
  other vias: 13.97,57.15
N$28
  Bottom 0.254: X_JP1.3 30.48,36.83 7.62,36.83 1X.1
N$29  (via drill 0.61)
  Top 0.254: X_JP1.4 v29.21,33.02
  Bottom 0.254: v29.21,33.02 8.89,33.02 7.62,31.75 1X.2
N$30  (via drill 0.61)
  Top 0.254: X_JP1.5 v26.67,31.75
  Bottom 0.254: v26.67,31.75 12.7,31.75 7.62,26.67 2X.1
N$31  (via drill 0.61)
  Top 0.254: v22.86,29.21 24.13,30.48 X_JP1.6
  Bottom 0.254: v22.86,29.21 22.86,24.13 10.16,24.13 7.62,21.59 2X.2
N$35
  Bottom 0.254: X_JP2.3 X_JP2.4
N$40
  Top 0.254: SV2.20 41.91,19.05 R9.2
PIN_CYCLESTART  (via drill 0.61)
  Top 0.254: v77.47,15.24 77.47,16.51 74.93,16.51 71.12,20.32 71.12,24.13 69.85,24.13 68.58,22.86 68.58,19.05 66.04,19.05 62.23,15.24 5.3 | v109.22,73.66 105.41,73.66 105.41,66.04 106.68,64.77 R16.1
  Bottom 0.254: R16.1 106.68,64.77 102.87,68.58 99.06,68.58 96.52,71.12 START.2 | v77.47,15.24 78.74,13.97 81.28,13.97 82.55,12.7 99.06,12.7 104.14,17.78 107.95,17.78 113.03,22.86 113.03,73.66 v109.22,73.66
PIN_FEEDHOLD  (via drill 0.61)
  Top 0.254: v109.22,69.85 109.22,36.83 106.68,34.29 R15.1 106.68,31.75 105.41,30.48 105.41,16.51 v100.33,11.43 | v62.23,11.43 62.23,12.7 59.69,15.24 5.2
  Bottom 0.254: v109.22,69.85 105.41,73.66 88.9,73.66 86.36,71.12 HOLD.2 | v100.33,11.43 v62.23,11.43
PIN_RESET  (via drill 0.61)
  Top 0.254: v86.36,44.45 86.36,53.34 81.28,58.42 81.28,66.04 76.2,71.12 RESET.2 | 5.1 57.15,5.08 58.42,3.81 69.85,3.81 69.85,10.16 77.47,10.16 77.47,6.35 78.74,5.08 93.98,5.08 v93.98,36.83
  Bottom 0.254: R14.1 106.68,43.18 105.41,44.45 v86.36,44.45 v93.98,36.83
PWM  (via drill 0.61)
  Top 0.254: v22.86,35.56 22.86,64.77 21.59,66.04 R17.2 | Q3.G 53.34,30.48 53.34,34.29 IC1.5
  Bottom 0.254: v22.86,35.56 24.13,34.29 40.64,34.29 41.91,35.56 48.26,35.56 49.53,36.83 IC1.5
R/W  (via drill 0.61)
  Top 0.254: v81.28,34.29 82.55,33.02 SV2.5
  Bottom 0.254: IC1.25 48.26,34.29 49.53,35.56 71.12,35.56 72.39,34.29 v81.28,34.29
RS  (via drill 0.61)
  Top 0.254: v39.37,31.75 39.37,17.78 38.1,16.51 v38.1,11.43 | v81.28,12.7 83.82,12.7 83.82,20.32 SV2.4
  Bottom 0.254: v39.37,31.75 IC1.26 | v38.1,11.43 60.96,11.43 62.23,12.7 v81.28,12.7
SCL  (via drill 0.61)
  Top 0.254: IC1.28 45.72,24.13 v45.72,17.78 | v74.93,40.64 3.1 | v80.01,35.56 80.01,33.02 81.28,31.75 81.28,13.97 78.74,11.43 v78.74,6.35
  Bottom 0.254: v45.72,17.78 44.45,16.51 31.75,16.51 | 31.75,16.51 29.21,16.51 26.67,19.05 CURRENT_SENSOR.3 | v80.01,35.56 v74.93,40.64 | v78.74,6.35 77.47,5.08 43.18,5.08 31.75,16.51
SDA  (via drill 0.61)
  Top 0.254: v25.4,26.67 25.4,21.59 CURRENT_SENSOR.4 | v71.12,77.47 71.12,69.85 77.47,63.5 3.2 | v54.61,77.47 53.34,76.2 53.34,59.69 52.07,58.42 46.99,58.42 46.99,44.45 45.72,43.18 45.72,31.75 IC1.27
  Bottom 0.254: IC1.27 40.64,26.67 v25.4,26.67 | v54.61,77.47 v71.12,77.47
SENSORV+  (via drill 0.61)
  Top 0.254: v80.01,54.61 81.28,53.34 81.28,41.91 IC2.2 | CURRENT_SENSOR.6 20.32,21.59 20.32,22.86 22.86,22.86 22.86,17.78 27.94,17.78 27.94,27.94 29.21,29.21 v29.21,30.48 | v39.37,48.26 v39.37,33.02
  Bottom 0.254: R7.2 76.2,58.42 v80.01,54.61 53.34,54.61 52.07,53.34 49.53,53.34 46.99,50.8 41.91,50.8 v39.37,48.26 | v29.21,30.48 31.75,33.02 v39.37,33.02
SENSORV-
  Top 0.254: CURRENT_SENSOR.5 21.59,10.16 7.62,10.16 LD.2
VCC
  Top 0.254: 59.69,25.4 60.96,26.67 IC3.20 63.5,31.75 63.5,44.45 | 63.5,44.45 63.5,46.99 IC3.12 63.5,52.07 63.5,57.15 7805.OUT | IC3.15 63.5,44.45 | X_JP2.7 X_JP2.6 24.13,29.21 25.4,30.48 25.4,44.45 | IC1.20 IC1.21 | Y_JP2.5 25.4,44.45 | 25.4,44.45 Y_JP2.6 | R19.2 36.83,66.04 34.29,66.04 Y_JP1.2 33.02,55.88 33.02,39.37 X_JP1.2 | 106.68,52.07 107.95,53.34 107.95,59.69 | 107.95,59.69 106.68,60.96 R4.2 | 107.95,59.69 107.95,68.58 106.68,69.85 R16.2 | 106.68,52.07 107.95,50.8 107.95,39.37 106.68,38.1 R14.2 | 106.68,52.07 R5.2 | SV2.2 88.9,20.32 88.9,10.16 86.36,7.62 L3.1 | 59.69,25.4 58.42,24.13 58.42,5.08 66.04,5.08 66.04,7.62 L5.1 | 59.69,25.4 R8.1
  Bottom 0.254: IC3.15 IC1.7 48.26,41.91 46.99,40.64 41.91,40.64 39.37,43.18 | X_JP2.6 X_JP2.5 27.94,24.13 39.37,24.13 | 36.83,21.59 35.56,20.32 CURRENT_SENSOR.1 | SV2.19 44.45,24.13 39.37,24.13 | 36.83,21.59 39.37,24.13 | 36.83,21.59 R6.1 | Y_JP2.6 Y_JP2.7 | IC1.21 41.91,43.18 39.37,43.18 | 33.02,43.18 27.94,43.18 Y_JP2.5 | 33.02,43.18 39.37,43.18 | 33.02,43.18 33.02,57.15 Y_JP1.2 | 73.66,10.16 68.58,10.16 66.04,7.62 L5.1 | 73.66,10.16 76.2,7.62 L4.1 | 83.82,10.16 86.36,7.62 L3.1 | 73.66,10.16 83.82,10.16 | 83.82,10.16 93.98,10.16 96.52,7.62 L6.1 | 106.68,29.21 104.14,26.67 95.25,26.67 SV2.2 | 106.68,29.21 109.22,29.21 109.22,35.56 106.68,38.1 R14.2 | 106.68,29.21 R15.2
XDIR  (via drill 0.61)
  Top 0.254: v97.79,33.02 97.79,55.88 100.33,58.42 8.2
  Bottom 0.254: X_JP2.1 57.15,25.4 58.42,24.13 88.9,24.13 v97.79,33.02
XSTEPS  (via drill 0.61)
  Top 0.254: v34.29,22.86 X_JP2.2 | v111.76,2.54 111.76,76.2 110.49,77.47 104.14,77.47 104.14,64.77 105.41,63.5 105.41,60.96 104.14,59.69 100.33,59.69 100.33,60.96 8.1
  Bottom 0.254: v34.29,22.86 25.4,22.86 25.4,2.54 v111.76,2.54
YDIR  (via drill 0.61)
  Top 0.254: v53.34,58.42 55.88,60.96 v55.88,78.74
  Bottom 0.254: Y_JP2.1 36.83,50.8 39.37,50.8 41.91,53.34 44.45,53.34 49.53,58.42 v53.34,58.42 | v55.88,78.74 102.87,78.74 111.76,69.85 111.76,58.42 7.15
YSTEPS  (via drill 0.61)
  Top 0.254: v48.26,59.69 50.8,62.23 v50.8,72.39
  Bottom 0.254: Y_JP2.2 34.29,52.07 38.1,52.07 41.91,55.88 44.45,55.88 v48.26,59.69 | v50.8,72.39 54.61,76.2 104.14,76.2 110.49,69.85 110.49,62.23 104.14,62.23 102.87,60.96 7.16
ZDIR  (via drill 0.61)
  Top 0.254: IC3.18 58.42,36.83 v58.42,52.07
  Bottom 0.254: v58.42,52.07 59.69,53.34 97.79,53.34 99.06,54.61 101.6,54.61 102.87,55.88 7.14
ZEN
  Top 0.254: IC3.10 68.58,62.23 67.31,63.5 2.7
  Bottom 0.254: R21.2 43.18,66.04 45.72,66.04 46.99,67.31 64.77,67.31 67.31,64.77 2.7 67.31,63.5
ZSTEPS
  Bottom 0.254: IC3.17 58.42,39.37 58.42,40.64 62.23,40.64 67.31,45.72 92.71,45.72 99.06,52.07 104.14,52.07 105.41,53.34 105.41,57.15 101.6,57.15 100.33,55.88 8.3

### Text on the board
Top: Risha Mega Shield